# EAGLE design Osus-master (EAGLE 5.11)
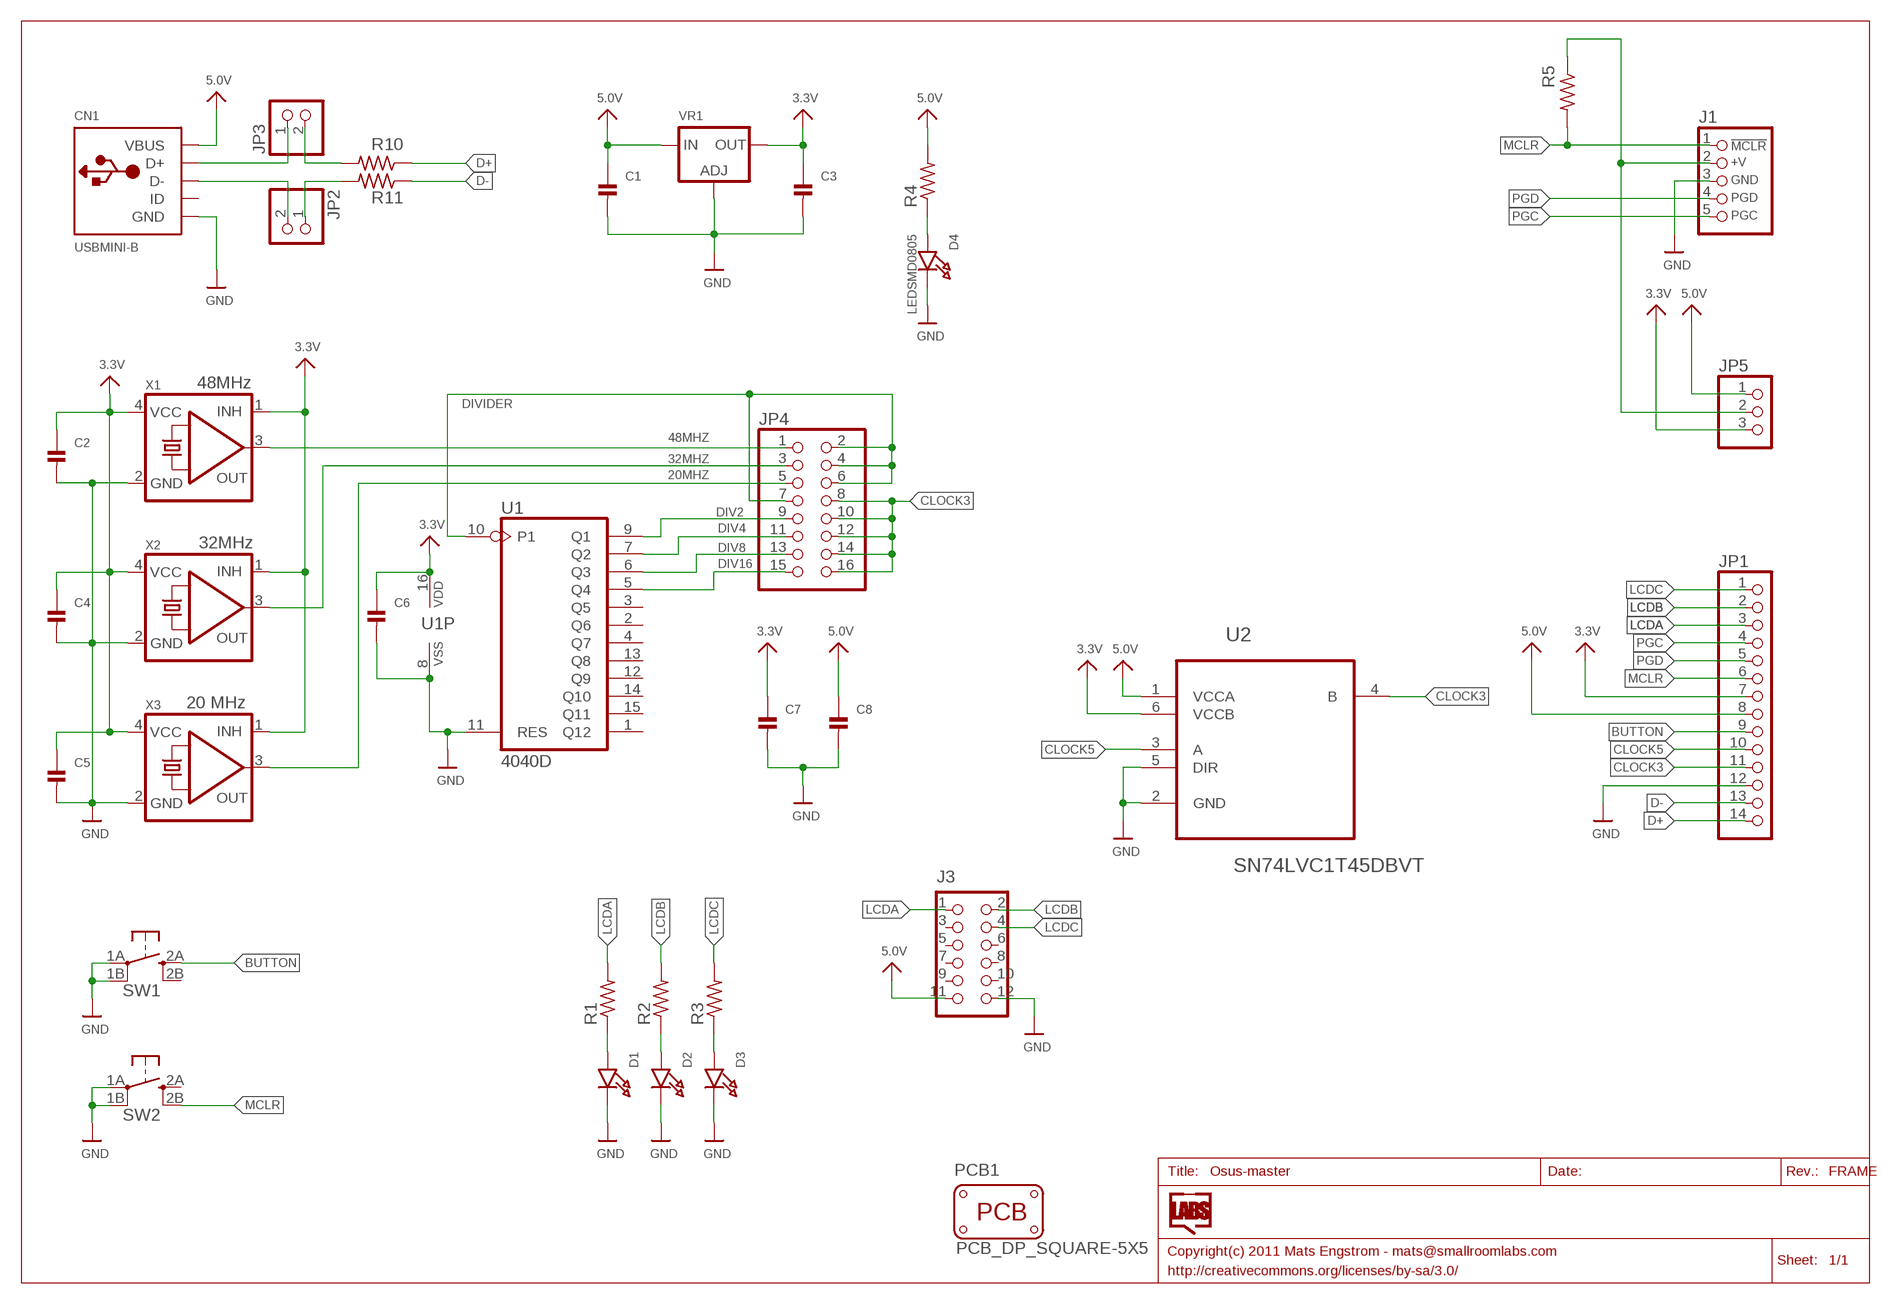
[diagram p0: schematic, sheet 1]

## Parts
C1  CAP_CERAMIC1206  [1206]
C2  CAP_CERAMIC0805  [0805]
C3  CAP_CERAMIC1206  [1206]
C4  CAP_CERAMIC0805  [0805]
C5  CAP_CERAMIC0805  [0805]
C6  CAP_CERAMIC0805  [0805]
C7  CAP_CERAMIC0805  [0805]
C8  CAP_CERAMIC0805  [0805]
CN1  USBMINI-B  [MOLEX67503]
D1  LEDSMD0805  [CHIPLED_0805]
D2  LEDSMD0805  [CHIPLED_0805]
D3  LEDSMD0805  [CHIPLED_0805]
D4  LEDSMD0805  [CHIPLED_0805]
J1  CON_HEADER_PRG_PIC_ICSPB  [HEADER_PRG_1X05_ICSP_B]
J3  CON_HEADER_2X06-PTH+SHROUDED  [PINSHRD_PTH_2X06]
JP1  PINHD-1X14  [1X14]
JP2  HEADER-1X2ROUND  [1X02_ROUND]
JP3  HEADER-1X2ROUND  [1X02_ROUND]
JP4  HEADER-2X8  [2X08]
JP5  HEADER-1X3ROUND  [1X03_ROUND]
PCB1  PCB_DP_SQUARE-5X5  [DP5050_V1]
R1  RES0805A  [R0805A]
R2  RES0805A  [R0805A]
R3  RES0805A  [R0805A]
R4  RES0805A  [R0805A]
R5  RES0805A  [R0805A]
R10  RES0805A  [R0805A]
R11  RES0805A  [R0805A]
SW1  TACTILETAO1  [EVQ-Q2-TAO1]
SW2  TACTILETAO1  [EVQ-Q2-TAO1]
U1  4040D  [SO16]
U2  SN74LVC1T45DBVT  [SOT95P280X145-6N]
VR1  LM1117SOT223-WAVE  [SOT223-W]
X1  OSCILLATOR  [OSC_7X5MM]
X2  OSCILLATOR  [OSC_7X5MM]
X3  OSCILLATOR  [OSC_7X5MM]

## Nets
3.3V: C2.1 C3.1 C4.1 C5.1 C6.1 C7.1 JP1.7 JP5.3 U1.16(VDD) U2.6(VCCB) VR1.2(OUT) X1.1(INH) X1.4(VCC) X2.1(INH) X2.4(VCC) X3.1(INH) X3.4(VCC)
5.0V: C1.1 C8.1 CN1.VBUS J3.11 JP1.8 JP5.1 R4.2 U2.1(VCCA) VR1.3(IN)
20MHZ: JP4.5 X3.3(OUT)
32MHZ: JP4.3 X2.3(OUT)
48MHZ: JP4.1 X1.3(OUT)
BUTTON: JP1.9 SW1.2A
CLOCK3: JP1.11 JP4.8 JP4.10 JP4.12 JP4.14 JP4.16 U2.4(B)
CLOCK5: JP1.10 U2.3(A)
D+: JP1.14 R10.1
D-: JP1.13 R11.1
DIV2: JP4.9 U1.9(Q1)
DIV4: JP4.11 U1.7(Q2)
DIV8: JP4.13 U1.6(Q3)
DIV16: JP4.15 U1.5(Q4)
DIVIDER: JP4.2 JP4.4 JP4.6 JP4.7 U1.10(P1)
GND: C1.2 C2.2 C3.2 C4.2 C5.2 C6.2 C7.2 C8.2 CN1.GND D1.C D2.C D3.C D4.C J1.3(GND) J3.12 JP1.12 SW1.1A SW1.1B SW2.1A SW2.1B U1.8(VSS) U1.11(RES) U2.2(GND) U2.5(DIR) VR1.1(ADJ) X1.2(GND) X2.2(GND) X3.2(GND)
LCDA: J3.1 JP1.3 R1.2
LCDB: J3.2 JP1.2 R2.2
LCDC: J3.4 JP1.1 R3.2
MCLR: J1.1(/MCLR) JP1.6 R5.2 SW2.2B
N$1: CN1.D- JP2.2
N$2: J1.2(+V) JP5.2 R5.1
N$3: JP2.1 R11.2
N$4: D1.A R1.1
N$5: D2.A R2.1
N$6: D3.A R3.1
N$8: D4.A R4.1
N$11: JP3.2 R10.2
N$12: CN1.D+ JP3.1
PGC: J1.5(PGC) JP1.4
PGD: J1.4(PGD) JP1.5
Unconnected: CN1.ID J3.3 J3.5 J3.6 J3.7 J3.8 J3.9 J3.10 SW1.2B SW2.2A U1.1(Q12) U1.2(Q6) U1.3(Q5) U1.4(Q7) U1.12(Q9) U1.13(Q8) U1.14(Q10) U1.15(Q11)

## Notes on the sheet
- 48MHz
- 32MHz
- 20 MHz

## Library data of the parts
C1-C8 = microbuilder:CAP_CERAMIC: Ceramic Capacitors 0402 - 0402 Surface Mount Capacitors 0.1uF 10V 10% [Digikey: 490-1318-2-ND] 0603 - 0603 Surface Mount Capacitors 16 pF 50V 5% [Digikey: 445-5051-2-ND] 22 pF 50V [Digikey: PCC220ACVTR-ND] 33 pF 50V 5% [Digikey: 490-1415-1-ND] 56pF 50V 5% [Digikey: 490-1421-1-ND] 220pF 50V 5% [Digikey: 445-1285-1-ND] 680 pF 50V 2200 pF 50V 5% C0G [Digikey: 445-1297-1-ND] 5600 pF 100V 5% X7R [Digikey: 478-3711-1-ND] 0.1 µF 25V 10% [Digikey: PCC2277TR-ND] 0.22 µF 16V 10% X7R [Digikey: 445-1318-1-ND] 1.0 µF 25V 10% [Digikey: 445-5146-2-ND] 0603 - RF Specific 3pF 250V +/-0.1pF RF [Digikey: 712-1347-1-ND] 18 pF 250V 5% [Digikey: 478-3505-1-ND or 712-1322-1-ND] 56 pF 250V 5% C0G RF [Digikey: 490-4867-1-ND] 68 pF 250V RF [Digikey: 490-4868-1-ND] 0805 - 0805 Surface Mount Capacitors 220 pF 250V 2% RF Ceramic Capacitor [Digikey: 712-1398-1-ND] 1000 pF 50V 2% NP0 Ceramic Capacitor [Digikey: 478-3760-1-ND] 0.1 µF 25V 10% Ceramic Capacitor [Digikey: PCC1828TR-ND] 1.0 µF 16V 10% Ceramic Capacitor[Digikey: 490-1691-2-ND] 10.0 µF 10V 10% Ceramic Capacitor[Digikey: 709-1228-1-ND] 1206 - 1206 Surface Mount Capacitors
CN1 = SmallRoomLabs:USB
D1-D4 = SmallRoomLabs:LED
J1 = dp_devices:CON_HEADER_PRG_PIC_ICSP: 5-pin PIC In Circuit Serial Programming header
J3 = dp_devices:CON_HEADER_2X06: 2x5 Pin header
JP1 = pinhead:PINHD-1X14: PIN HEADER
JP2 JP3 = microbuilder:HEADER-1X2: PIN HEADER
JP4 = microbuilder:HEADER-2X8
JP5 = microbuilder:HEADER-1X3: PIN HEADER
PCB1 = dp_devices:PCB_DP_SQUARE: Dangerous Prototypes Standard Square PCB sizes
R1-R5 R10 R11 = SmallRoomLabs:RES
SW1 SW2 = SmallRoomLabs:TACTILE
U1 = 40xx:4040: 12-stage binary/ripple COUNTER
U2 = SmallRoomLabs:SN74LVC1T45DBVT: BUS Transceiver; MPN: SN74LVC1T45DBVT; OC_FARNELL: 1470916; OC_NEWARK: 01J0796; PACKAGE: SOT-23; SUPPLIER: Texas Instruments
VR1 = microbuilder:LM1117: LM1117 Voltage Regulator LM1117 Adjustable Voltage regulator [Digikey: LM1117IMP-ADJDKR-ND] LM1117 3.3V Voltage regulator [AP1117E33GDIDKR-ND] LM1117 5.0V Voltage regulator [AP1117E50GDIDKR-ND] SOT223-REFLOW - SOT223 package for solder paste/reflow ovens SOT223-WAVE - SOT223 package for hand-soldering (larger pads) Note: For the fixed-voltage regulators, simply set the ADJ pin to GND.
X1-X3 = microbuilder:OSCILLATOR: Oscillators 3.2x2.5mm SMT 4.0MHz +/- 50ppm, 3.3V, 9mA, -40/+85°C - Digikey: 535-9752-1-ND 50MHz +/- 50ppm, 3.3V, 8mA, -10/+70°C - Digikey: 478-4792-1-ND 5x7mm SMT 4.0MHz +/-20ppm 3.3V, 20mA, -20/+70°C - Digikey: 535-9329-2-ND 50MHz +/- 25ppm 3.3V, 35mA, -40/+85°C - Digikey: 631-1197-1-ND

## Board
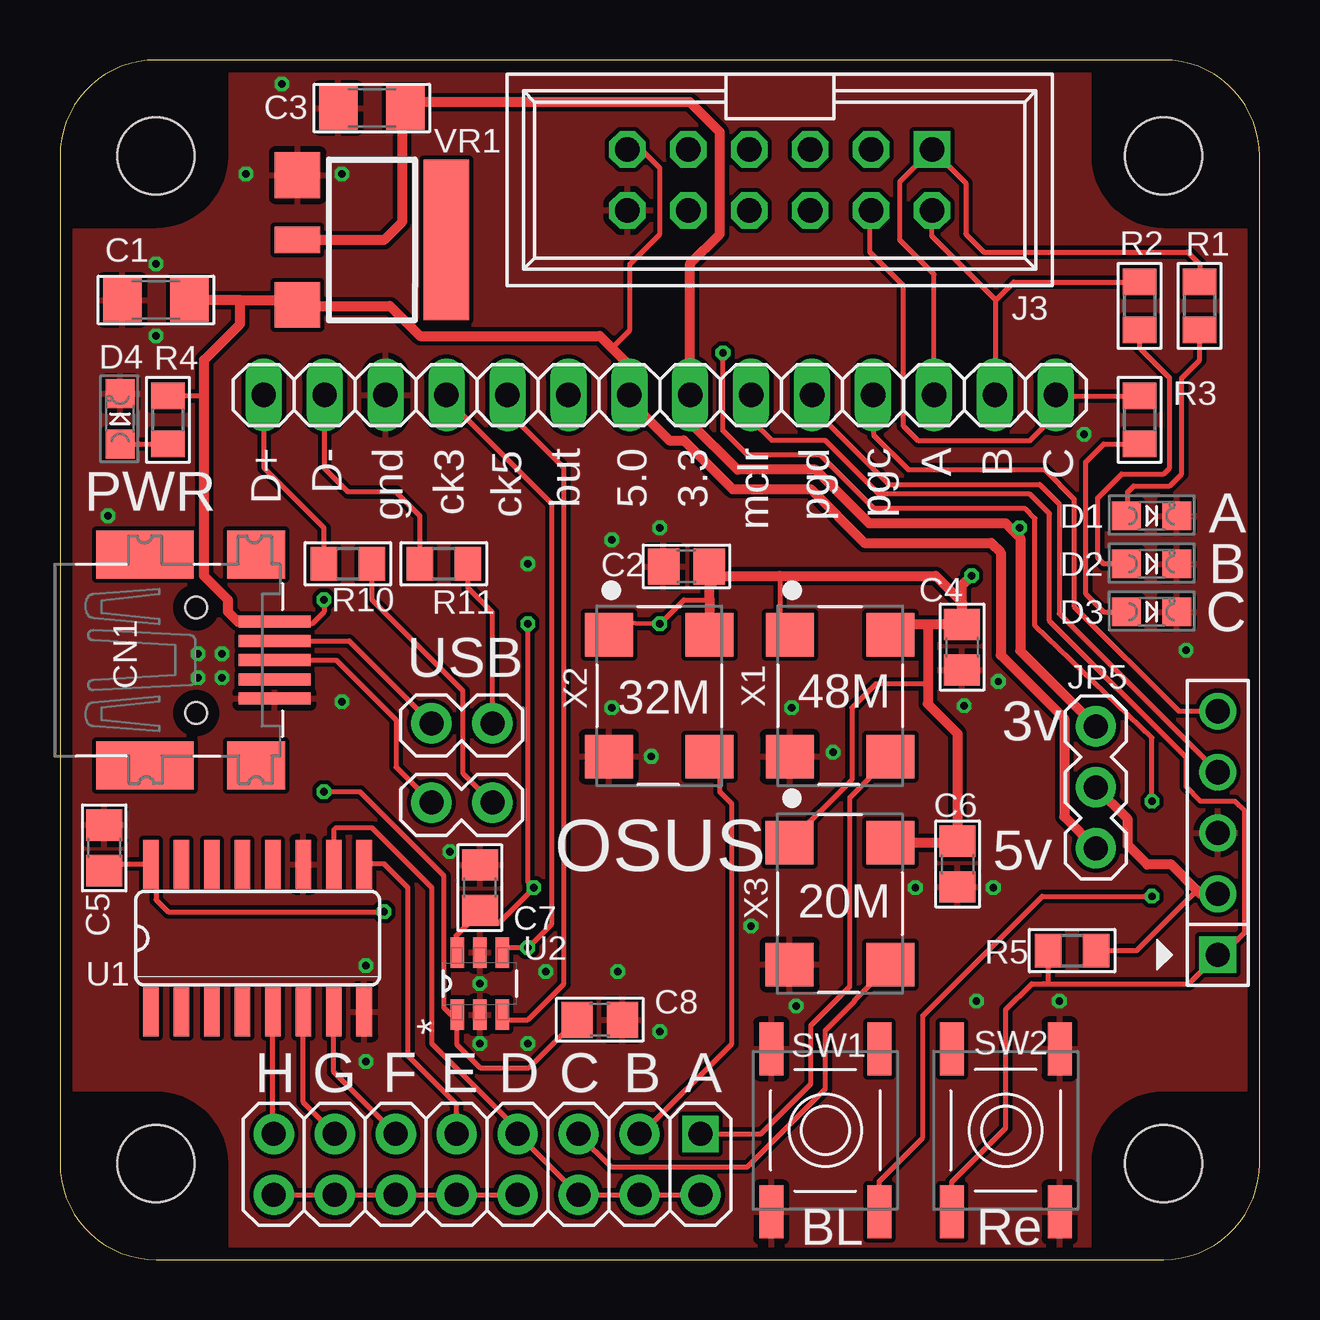
[diagram p1: board, top side]
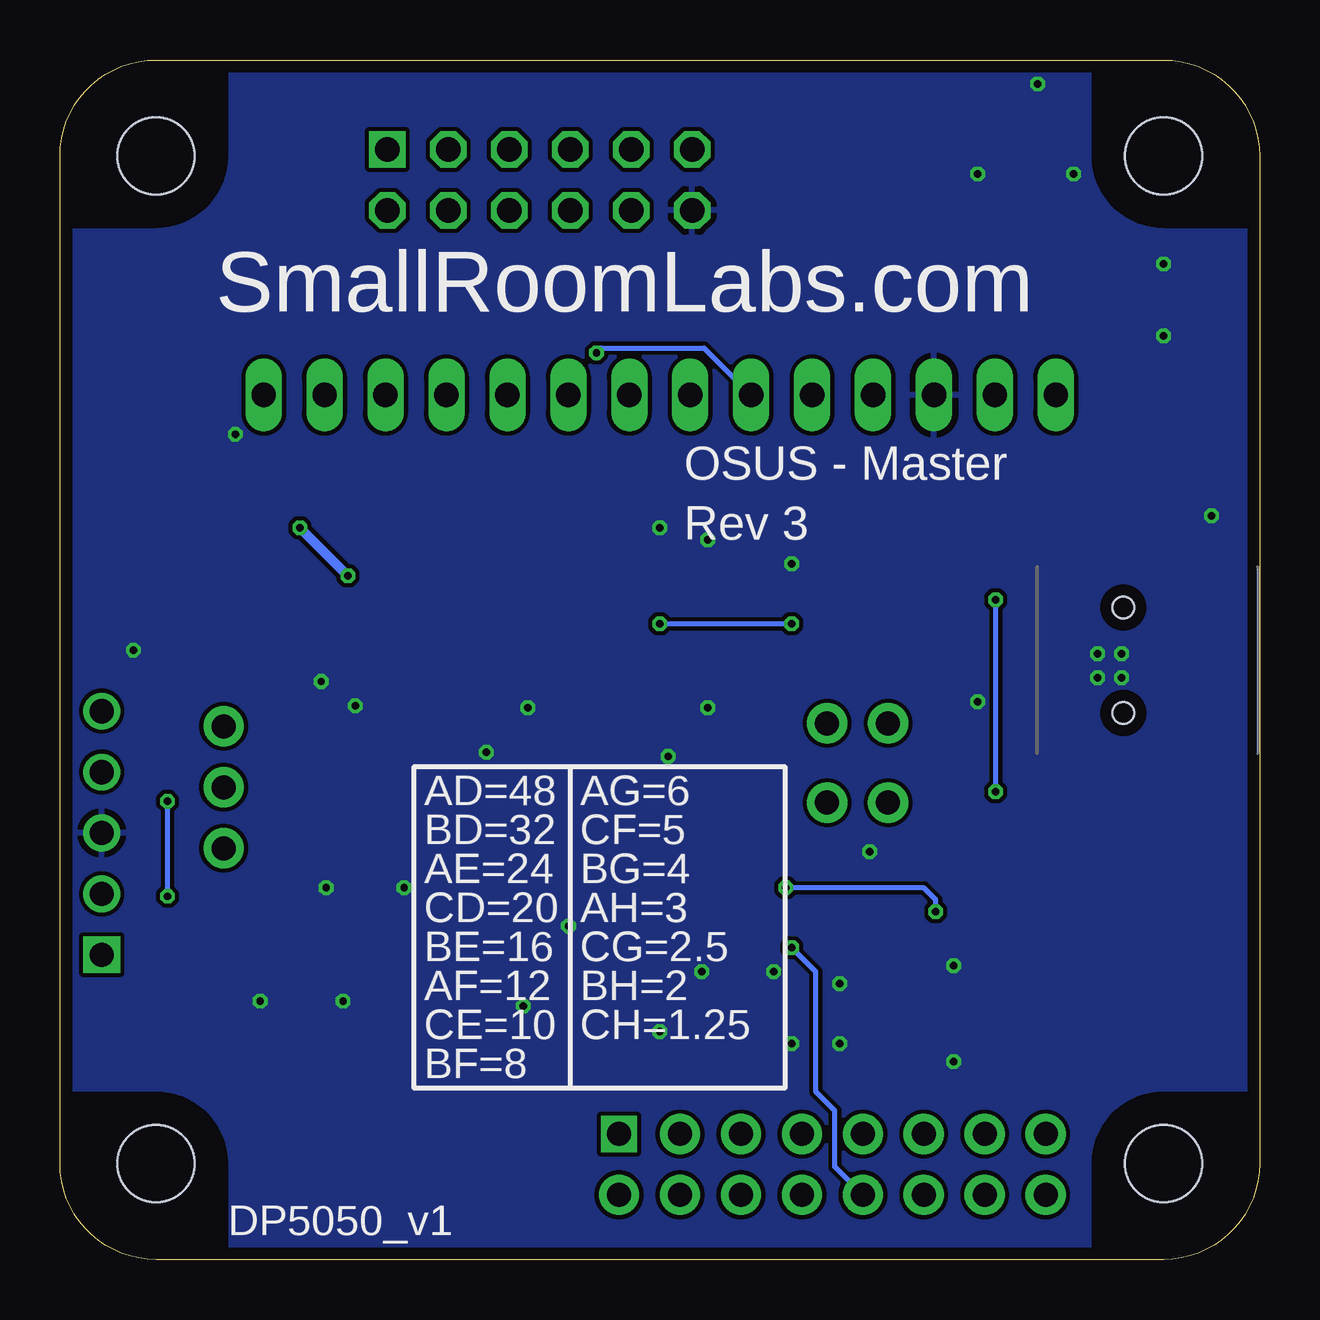
[diagram p2: board, bottom side, seen from below]

Size 50 x 50 mm. Coordinates in mm from the lower left corner, seen from the top.
Copper layers (1*16): Top 0.035mm / dielectric 1.5mm / Bottom 0.035mm
Design rules "SmartPrototyping": minimum track width 7mil, minimum drill 12mil, track to track 7mil, track to pad 7mil, pad to pad 7mil, via to via 7mil, smd to smd 0mil, copper to edge 20mil, drill to drill 10mil, minimum pad ring 10mil, minimum via ring 6mil, stop-mask expansion 2mil, vias tented up to drill 25mil, thermal gap 10mil

### Footprints (pad centres in the part's own frame; a part is rotated, then mirrored left to right if it is on the bottom)
1206 = smd 1.6 x 1.8: 1 -1.4,0; 2 1.4,0
0805 = smd 1.3 x 1.5: 1 -0.95,0; 2 0.95,0
MOLEX67503 = smd 0.5 x 3: D+ 0,3.264; D- -0.8,3.264; GND 1.6,3.264; ID 0.8,3.264; VBUS -1.6,3.264 | smd 2 x 4.064: GND1 -4.4,-2.135; GND4 4.4,-2.135 | smd 2 x 2.4: GND2 -4.4,2.5; GND3 4.4,2.5 | hole 0.9: -2.2,0; 2.2,0
CHIPLED_0805 = smd 1.2 x 1.2: A 0,-1.05; C 0,1.05
HEADER_PRG_1X05_ICSP_B = drill 1.016 square: 1 -5.08,0 | drill 1.016 round: 2 -2.54,0; 3 0,0; 4 2.54,0; 5 5.08,0
PINSHRD_PTH_2X06 = drill 1.016 square: 1 -6.35,-1.27 | drill 1.016 octagon: 2 -6.35,1.27; 3 -3.81,-1.27; 4 -3.81,1.27; 5 -1.27,-1.27; 6 -1.27,1.27; 7 1.27,-1.27; 8 1.27,1.27; 9 3.81,-1.27; 10 3.81,1.27; 11 6.35,-1.27; 12 6.35,1.27
1X14 = drill 1.016 long: 1 -16.51,0; 2 -13.97,0; 3 -11.43,0; 4 -8.89,0; 5 -6.35,0; 6 -3.81,0; 7 -1.27,0; 8 1.27,0; 9 3.81,0; 10 6.35,0; 11 8.89,0; 12 11.43,0; 13 13.97,0; 14 16.51,0
1X02_ROUND = drill 1 pad 1.676 round: 1 -1.27,0; 2 1.27,0
2X08 = drill 1 square: 1 -8.89,-1.27 | drill 1 pad 1.676 round: 2 -8.89,1.27; 3 -6.35,-1.27; 4 -6.35,1.27; 5 -3.81,-1.27; 6 -3.81,1.27; 7 -1.27,-1.27; 8 -1.27,1.27; 9 1.27,-1.27; 10 1.27,1.27; 11 3.81,-1.27; 12 3.81,1.27; 13 6.35,-1.27; 14 6.35,1.27; 15 8.89,-1.27; 16 8.89,1.27
1X03_ROUND = drill 1 pad 1.676 round: 1 -2.54,0; 2 0,0; 3 2.54,0
DP5050_V1 = hole 3.2: 4,4; 46,4; 46,46; 4,46
R0805A = smd 1.1 x 1.4: 1 -1,0; 2 1,0
EVQ-Q2-TAO1 = smd 2.2 x 1: 1A -3.4,2.25; 1B 3.4,2.25; 2A -3.4,-2.25; 2B 3.4,-2.25
SO16 = smd 0.66 x 2.032: 1 -4.445,-3.073; 2 -3.175,-3.073; 3 -1.905,-3.073; 4 -0.635,-3.073; 5 0.635,-3.073; 6 1.905,-3.073; 7 3.175,-3.073; 8 4.445,-3.073; 9 4.445,3.073; 10 3.175,3.073; 11 1.905,3.073; 12 0.635,3.073; 13 -0.635,3.073; 14 -1.905,3.073; 15 -3.175,3.073; 16 -4.445,3.073
SOT95P280X145-6N = smd 1.27 x 0.559: 1 -1.295,0.94; 2 -1.295,0; 3 -1.295,-0.94; 4 1.295,-0.94; 5 1.295,0; 6 1.295,0.94
SOT223-W = smd 1.9 x 1.9: 1 -2.7,-3.1; 3 2.7,-3.1 | smd 1.1 x 1.9: 2 0,-3.1 | smd 6.7 x 1.9: 4 0,3.1
OSC_7X5MM = smd 1.8 x 2: 1 -2.54,-2.1; 2 2.54,-2.1; 3 2.54,2.1; 4 -2.54,2.1

### Placement (x,y rotation side)
C1  4,40 180 top
C2  26.11,28.89 180 top
C3  13,48 180 top
C4  37.6,25.52 270 top
C5  1.85,17.16 90 top
C6  37.41,16.48 270 top
C7  17.5,15.5 90 top
C8  22.5,10 0 top
CN1  5.68,24.98 270 top
D1  45.5,31 270 top
D2  45.5,29 270 top
D3  45.5,27 270 top
D4  2.5,35.04 0 top
J1  48.26,17.78 90 top
J3  30,45 180 top
JP1  25,36.04 180 top
JP2  16.75,22.35 180 top
JP3  16.75,19.04 0 top
JP4  17.81,3.96 180 top
JP5  43.18,19.68 90 top
PCB1  0,0 0 top
R1  47.5,39.75 90 top
R2  45,39.75 90 top
R3  45,35 90 top
R4  4.5,35 90 top
R5  42.19,12.88 180 top
R10  12,29 0 top
R11  16,29 0 top
SW1  31.9,5.38 90 top
SW2  39.42,5.38 270 top
U1  8.24,13.39 0 top
U2  17.5,11.5 90 top
U$18  [SRL-LOGO-BSTOP-10MM]  37,21.5 0 top
VR1  13,42.5 270 top
X1  32.52,23.5 270 top
X2  24.98,23.5 270 top
X3  32.51,14.83 270 top

### Tracks (layer width: path | path; a pad name or v marks a point on that pad's centre or on a via)
3.3V  (via drill 0.3)
  Top 0.203: C5.1 2.14,16.5 3.5,16.5 3.53,16.47 U1.16 3.97,16.47 4,16.5 4,15 4.5,14.5 v13.5,14.5 | 16.5,12.86 U2.6 | 27.08,27.5 26,27.5 v25,26.5 22.96,26.54 X2.1 | X1.1 30,26.04 30,28.5 | X3.1 30.41,17.41 33,20 33,23 34,24 36.17,24 | 16.5,12.86 16.5,12.5 | 16.5,12.86 16.5,13.5 17,14 17.5,14 | 17.5,14 18.25,14 v19.75,15.5 19.5,15.75 v19.5,26.5 | 17.5,14 C7.1
  Top 0.406: VR1.2 13.5,42.5 14.25,43.25 14.25,47.85 | 14.65,48.25 26.25,48.25 27.5,47 27.5,42.75 26.27,41.52 JP1.7 26.27,34.89 28.25,32.92 31.5,32.92 33.73,30.68 39.42,30.68 39.9,30.2 | JP5.3 40.03,25.38 40.03,30.07 39.9,30.2 | C4.1 36.17,26.47 | C2.1 27,28.95 27,29 27.5,28.5 | 27.5,28.5 30,28.5 36.5,28.5 37.6,27.4 C4.1 | C4.1 37.6,28.1 v38,28.5 | v40,30.5 39.9,30.2 | X3.4 37.35,17.37 C6.1 37.41,21.92 36.17,23.16 36.17,24 36.17,26.47 | 36.17,26.47 35.05,26.47 X1.4 | X2.4 27.08,27.5 27.08,28.08 27.5,28.5
  Top 0.61: 14.25,47.85 C3.1 14.65,48.25
  Bottom 0.203: v13.5,14.5 13.5,15 14,15.5 v19.75,15.5 | v19.5,26.5 v25,26.5
  Bottom 0.406: v38,28.5 v40,30.5
5.0V  (via drill 0.3)
  Top 0.203: J3.11 24.23,46.27 25,45.5 25,42.75 23.75,41.5 23.75,38.75 23,38 | 6,36 R4.2 | v11,27.5 11,27 10.5,26.5 9.02,26.5 CN1.VBUS | C8.1 19.55,8 17.5,8 16.56,8.94 U2.1 16.3,10.21 16,10.5 16,16 12.5,19.5 v11,19.5
  Top 0.406: 7.5,40 C1.1 | 7.5,40 9.7,40 | CN1.VBUS 7.42,26.58 7,27 7,27.5 6,28.5 6,36 6,37.5 7.5,39 7.5,40 | VR1.3 9.95,39.75 13.75,39.75 15,38.5 22.5,38.5 23,38 23.75,37.25 23.75,36.06 JP1.8 23.73,35.81 25.4,34.14 26.01,34.14 28.04,32.11 31.29,32.11 33.53,29.87 38.81,29.87 39.22,29.46 39.22,25.2 41.86,22.55 41.86,18.47 JP5.1
  Top 0.61: 9.7,40 VR1.3
  Bottom 0.203: v11,19.5 v11,27.5
20MHZ
  Top 0.203: JP4.5 21.61,5.21 22.96,3.86 28.65,3.86 31.9,7.11 31.9,9.55 33.12,10.77 33.12,10.8 X3.3
32MHZ
  Top 0.203: JP4.3 24.23,5.23 28,9 28,19 27.5,19.5 27.5,20.54 X2.3
48MHZ
  Top 0.203: JP4.1 29.21,5.23 31.29,7.32 31.29,9.75 32.92,11.38 32.92,19.26 X1.3
BUTTON  (via drill 0.3)
  Top 0.203: v45.52,19.1 45.52,21.74 40.64,26.42 40.64,30.89 40.23,31.29 33.93,31.29 31.7,33.53 28.65,33.53 27.64,34.54 v27.64,37.8 | SW1.2A 34.15,3.27 35.97,5.08 35.97,10.16 40.95,15.14 v45.52,15.14
  Bottom 0.203: v45.52,15.14 v45.52,19.1 | v27.64,37.8 27.43,38 23.15,38 JP1.9
CLOCK3  (via drill 0.3)
  Top 0.203: JP4.16 JP4.14 JP4.12 JP4.10 JP4.8 | JP1.11 16.11,35.89 20.5,31.5 20.5,14 v19.5,13 18.64,13 U2.4
  Bottom 0.203: JP4.10 17.7,3.86 17.7,6.2 18.5,7 18.5,12 v19.5,13
CLOCK5
  Top 0.203: JP1.10 18.65,35.35 21,33 21,11.5 19.5,10 18.64,10 U2.3
D+
  Top 0.203: R10.1 11,30.5 8.5,33 JP1.14
D-
  Top 0.203: R11.1 15,31 14,32 12,32 11.25,32.75 11.03,32.97 | 11.03,32.97 11,33 | 11.03,32.97 JP1.13
DIV2
  Top 0.203: JP4.9 16.54,6.46 14.5,8.5 14.5,15.5 13.5,16.5 12.72,16.5 U1.9
DIV4
  Top 0.203: U1.7 11.41,7.81 JP4.11
DIV8
  Top 0.203: U1.6 10.14,6.54 JP4.13
DIV16
  Top 0.203: U1.5 8.87,6.27 JP4.15
DIVIDER
  Top 0.203: JP4.2 JP4.4 JP4.6 JP4.7 19.07,5.42 15.5,9 15.5,15.5 13,18 11.5,18 11.41,17.91 U1.10
GND  (via drill 0.3)
  other vias: 11.75,45.25 9.25,49 4,41.5 4,38.5 7.75,45.25 12.75,8.25 6.75,24.25 6.75,25.25 2,31 32.23,21.14 24.65,20.97 28.8,13.9 23,23 37.69,23.08 39.11,24.09 35.66,15.5 38.91,15.5 41.66,10.77 30.5,23 30.68,10.57 46.94,25.4 12.75,12.25 23.25,12 25,9.5 20.25,12 17.5,9 17.5,11.5 25,30.5 23,30 19.5,29 5.75,24.25 5.75,25.25 38.2,10.77 19.5,9 16.25,17 11.75,23.25 42.69,34.4
  pour Top: 20,50 46,50 arc-90 50,46 50,20 50,4 arc-90 46,0 20,0 4,0 arc-90 0,4 0,30 0,46 arc-90 4,50
  pour Bottom: 20,50 46,50 arc-90 50,46 50,20 50,4 arc-90 46,0 20,0 4,0 arc-90 0,4 0,30 0,46 arc-90 4,50
LCDA
  Top 0.203: R1.2 47.5,41.5 47,42 38.5,42 37.75,42.75 37.75,44.87 J3.1 35,44.92 35,42.5 36.43,41.07 JP1.3
LCDB
  Top 0.203: J3.2 36.35,42.65 39,40 | 39,40 39,36.07 JP1.2 | R2.2 39.75,40.75 39,40
LCDC
  Top 0.203: R3.2 42.05,36 JP1.1 41.51,35.21 40.44,34.14 35.76,34.14 35.15,34.75 35.15,40.6 33.75,42 33.75,43.67 J3.4
MCLR
  Top 0.203: JP1.6 28.81,34.99 29.67,34.14 31.9,34.14 34.14,31.9 40.44,31.9 41.25,31.09 41.25,26.62 46.94,20.93 46.94,19.71 47.55,19.1 48.97,19.1 49.38,18.69 49.38,13.63 48.45,12.7 J1.1 47.06,11.5 41.19,11.5 | SW2.2B 37.17,3.24 39.42,5.49 39.42,10.42 40.5,11.5 41,11.5 41.19,11.5 | 41.19,11.5 R5.2
N$1
  Top 0.203: CN1.D- 12.05,25.78 JP2.2
N$2
  Top 0.203: R5.1 44.88,12.88 47.39,15.39
  Top 0.406: J1.2 47.55,15.24 47.39,15.39 46.33,16.46 45.31,16.46 44.5,17.27 44.5,18.36 JP5.2
N$3
  Top 0.203: R11.2 17,28 18.02,26.98 JP2.1
N$4
  Top 0.203: D1.A 44.5,31 44.5,32 44.75,32.25 46.25,32.25 46.75,32.75 46.75,36.75 47.5,37.5 R1.1
N$5
  Top 0.203: D2.A 43.5,29 43.25,29.25 43.25,31.75 44.25,32.75 46,32.75 46.25,33 46.25,36.75 45,38 R2.1
N$6
  Top 0.203: D3.A 43.5,27 42.75,27.75 42.75,33.25 43.5,34 R3.1
N$8
  Top 0.203: R4.1 D4.A
N$11
  Top 0.203: JP3.2 16.8,20.27 16.8,23.7 13,27.5 R10.2
N$12
  Top 0.203: CN1.D+ 11.52,24.98 14,22.5 14,20.53 JP3.1
PGC
  Top 0.203: J1.5 46.63,22.86 42.27,27.23 42.27,31.7 41.05,32.92 35.36,32.92 33.93,34.34 33.93,35.99 JP1.4
PGD
  Top 0.203: JP1.5 31.35,35.5 34.54,32.31 40.84,32.31 41.66,31.5 41.66,26.92 J1.4

### Text on the board
tPlace: D+ | D- | gnd | ck3 | ck5 | but | 5.0 | 3.3 | mclr | pgd | pgc | A | B | C | PWR | A | B | USB | C | 32M | 48M | 3v | OSUS | 5v | 20M | H | G | F | E | D | C | B | A | BL | Re
bPlace: SmallRoomLabs.com | OSUS - Master | Rev 3 | AG=6 | AD=48 | CF=5 | BD=32 | BG=4 | AE=24 | AH=3 | CD=20 | CG=2.5 | BE=16 | BH=2 | AF=12 | CH=1.25 | CE=10 | BF=8